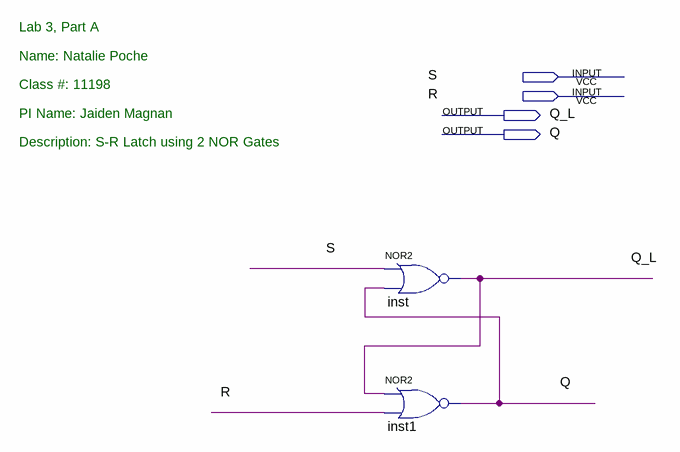
[diagram p0: schematic sheet]
// Quartus schematic S-R_Latch_2NOR.bdf as structural Verilog: 2 symbols, 4 pins
module \S-R_Latch_2NOR  (
  input  S,
  input  R,
  output Q_L,
  output Q
);

  nor inst (Q_L, S, Q);
  nor inst1 (Q, Q_L, R);

  // Notes on the sheet:
  //   Lab 3, Part A
  //   Name: Natalie Poche
  //   Class #: 11198
  //   PI Name: Jaiden Magnan
  //   Description: S-R Latch using 2 NOR Gates
endmodule
